# EAGLE design led_cube_final (EAGLE 6.5.0)
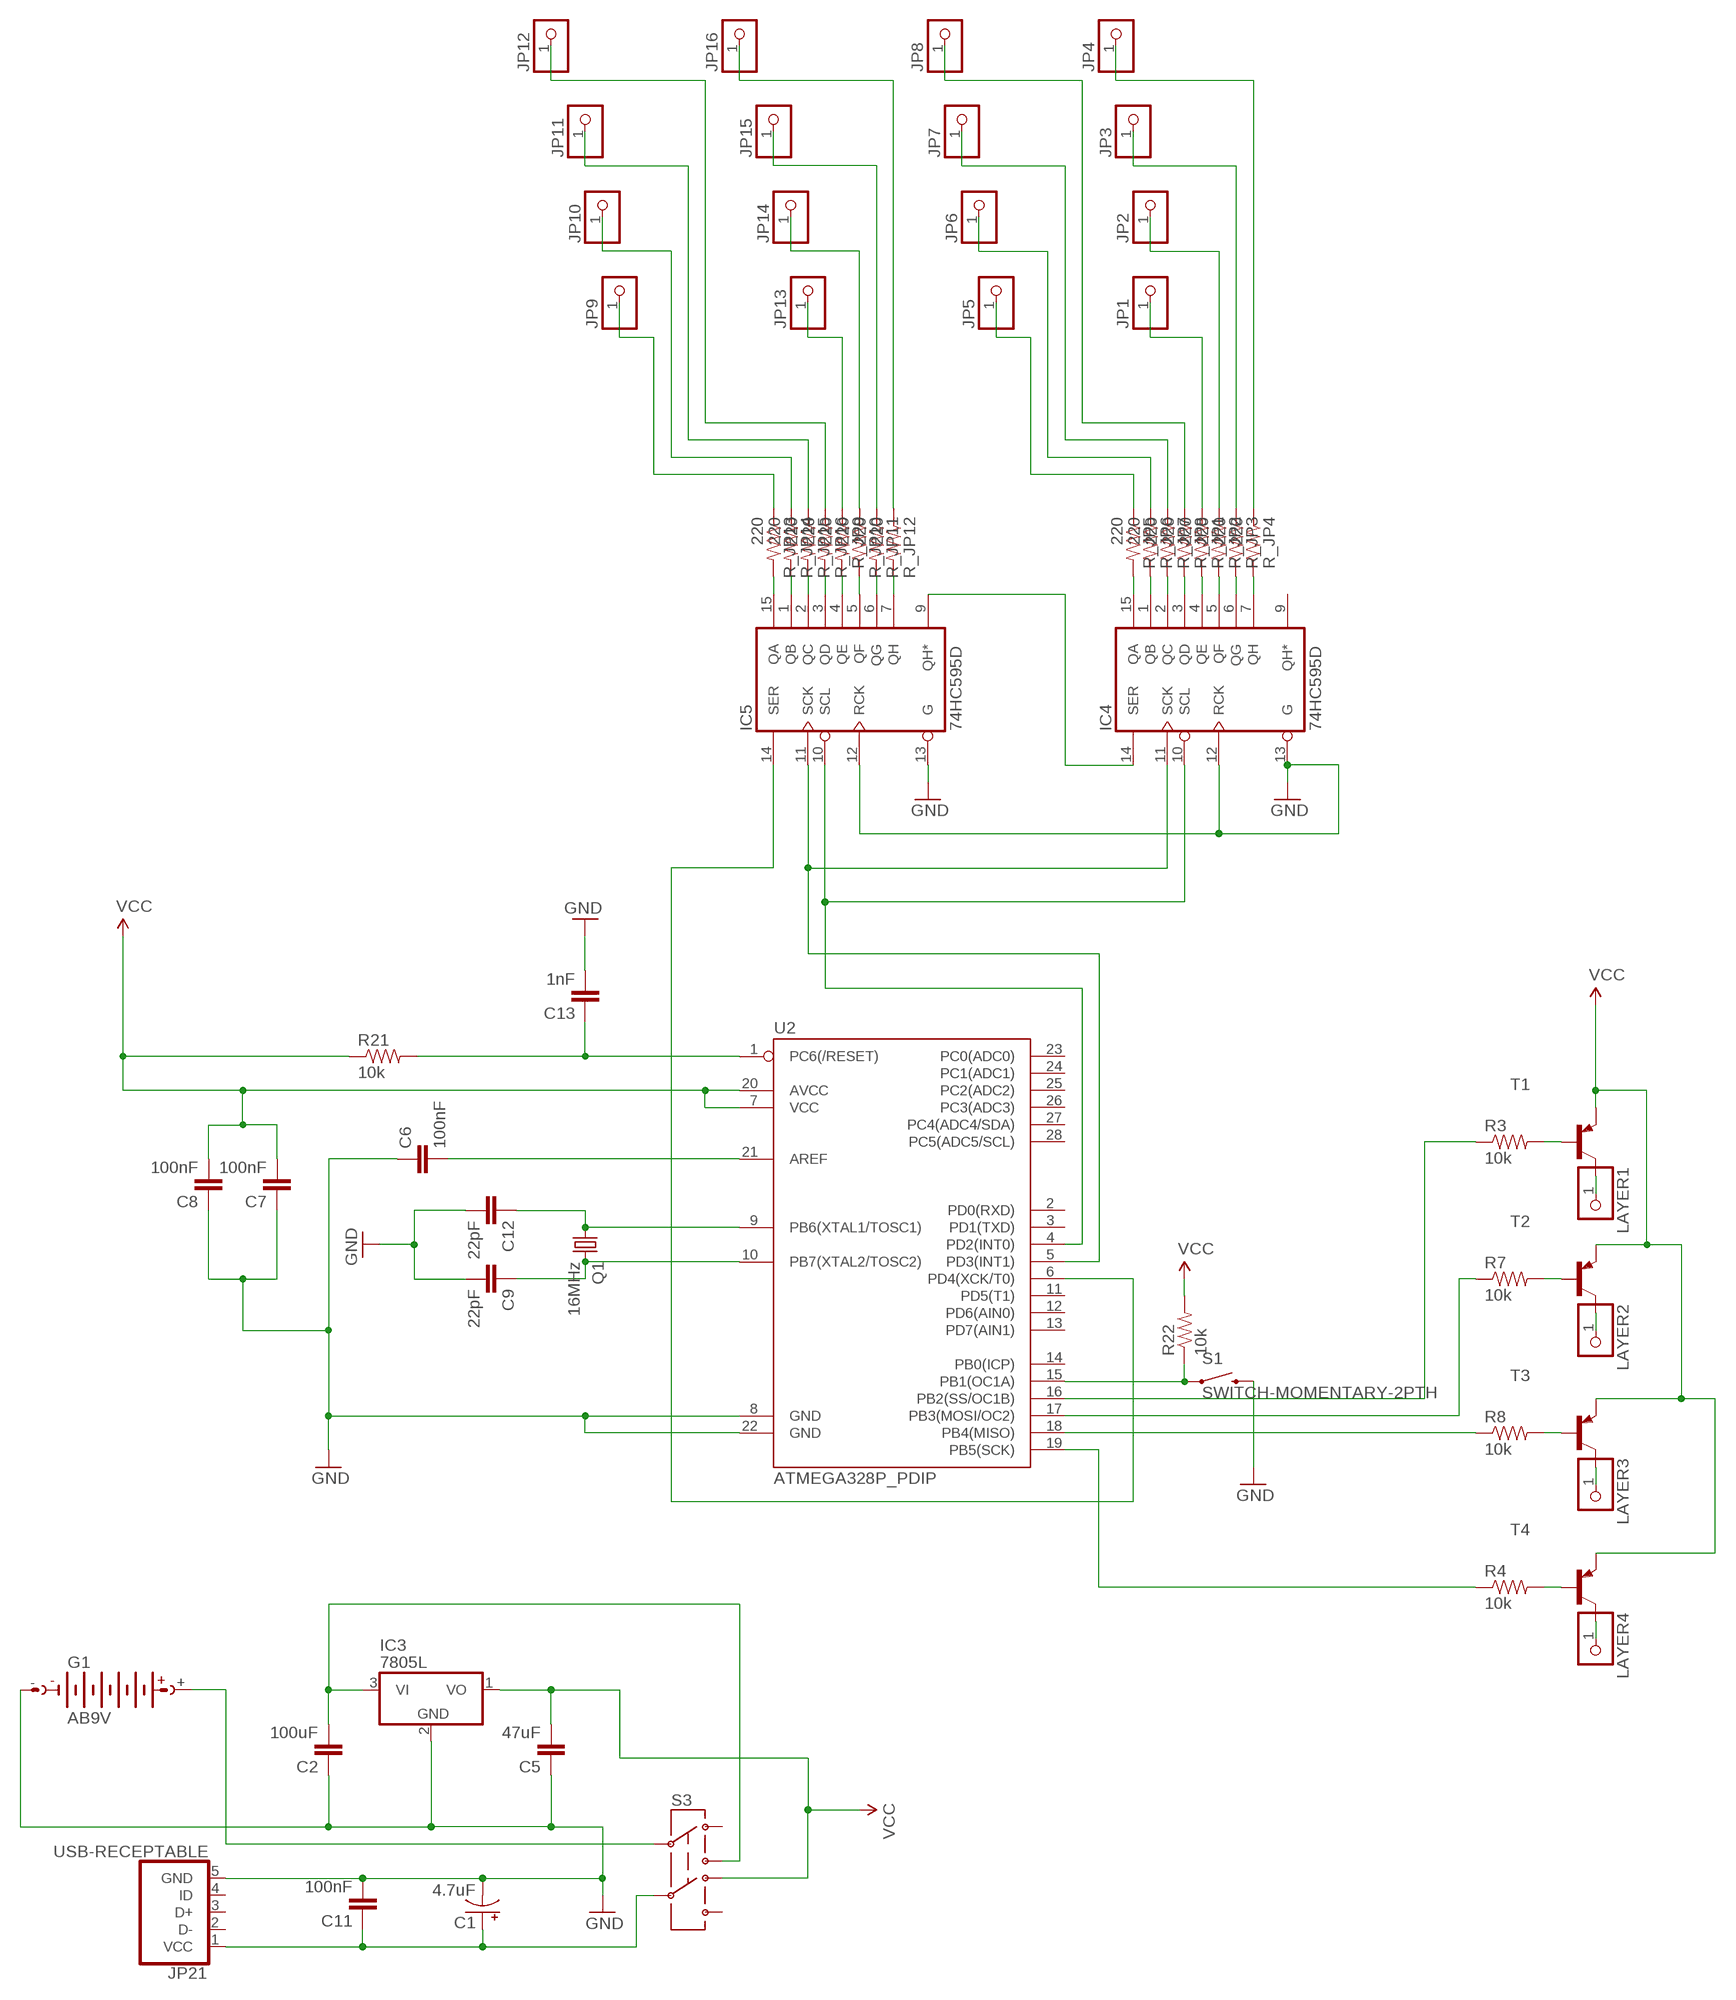
[diagram p0: schematic, sheet 1]

## Parts
C1  4.7uF  CPOL-USE2-5  [E2-5]
C2  100uF  CAP0805  [0805]
C5  47uF  CAP0805  [0805]
C6  100nF  CAP0805  [0805]
C7  100nF  CAP0805  [0805]
C8  100nF  CAP0805  [0805]
C9  22pF  CAP0805  [0805]
C11  100nF  CAP0805  [0805]
C12  22pF  CAP0805  [0805]
C13  1nF  CAP0805  [0805]
G1  AB9V  [AB9V]
IC3  7805L  [TO92]
IC4  74HC595D  [SO16]
IC5  74HC595D  [SO16]
JP1  PINHD-1X1  [1X01]
JP2  PINHD-1X1  [1X01]
JP3  PINHD-1X1  [1X01]
JP4  PINHD-1X1  [1X01]
JP5  PINHD-1X1  [1X01]
JP6  PINHD-1X1  [1X01]
JP7  PINHD-1X1  [1X01]
JP8  PINHD-1X1  [1X01]
JP9  PINHD-1X1  [1X01]
JP10  PINHD-1X1  [1X01]
JP11  PINHD-1X1  [1X01]
JP12  PINHD-1X1  [1X01]
JP13  PINHD-1X1  [1X01]
JP14  PINHD-1X1  [1X01]
JP15  PINHD-1X1  [1X01]
JP16  PINHD-1X1  [1X01]
JP21  USB-RECEPTABLE  [FCI-10103594-0001LF]
LAYER1  PINHD-1X1  [1X01]
LAYER2  PINHD-1X1  [1X01]
LAYER3  PINHD-1X1  [1X01]
LAYER4  PINHD-1X1  [1X01]
Q1  16MHz  CRYSTALHC49S  [HC49/S]
R3  10k  RESISTOR0805-RES  [0805]
R4  10k  RESISTOR0805-RES  [0805]
R7  10k  RESISTOR0805-RES  [0805]
R8  10k  RESISTOR0805-RES  [0805]
R21  10k  RESISTOR0805-RES  [0805]
R22  10k  RESISTOR0805-RES  [0805]
R_JP1  220  RESISTOR0805-RES  [0805]
R_JP2  220  RESISTOR0805-RES  [0805]
R_JP3  220  RESISTOR0805-RES  [0805]
R_JP4  220  RESISTOR0805-RES  [0805]
R_JP5  220  RESISTOR0805-RES  [0805]
R_JP6  220  RESISTOR0805-RES  [0805]
R_JP7  220  RESISTOR0805-RES  [0805]
R_JP8  220  RESISTOR0805-RES  [0805]
R_JP9  220  RESISTOR0805-RES  [0805]
R_JP10  220  RESISTOR0805-RES  [0805]
R_JP11  220  RESISTOR0805-RES  [0805]
R_JP12  220  RESISTOR0805-RES  [0805]
R_JP13  220  RESISTOR0805-RES  [0805]
R_JP14  220  RESISTOR0805-RES  [0805]
R_JP15  220  RESISTOR0805-RES  [0805]
R_JP16  220  RESISTOR0805-RES  [0805]
S1  SWITCH-MOMENTARY-2PTH  [TACTILE-PTH]
S3  SWITCH-DPDTOS  [OS]
T1  BC327-16-PNP-TO92-EBC  [TO92-EBC]
T2  BC327-16-PNP-TO92-EBC  [TO92-EBC]
T3  BC327-16-PNP-TO92-EBC  [TO92-EBC]
T4  BC327-16-PNP-TO92-EBC  [TO92-EBC]
U2  ATMEGA328P_PDIP  [DIL28-3]

## Nets
GND: C1.- C2.1 C5.1 C6.1 C7.1 C8.1 C9.2 C11.2 C12.2 C13.2 G1.- IC3.2(GND) IC4.12(RCK) IC4.13(G) IC5.12(RCK) IC5.13(G) JP21.5(GND) S1.3 U2.8(GND) U2.22(GND)
N$1: R4.2 T4.B
N$2: R3.2 T1.B
N$3: R7.2 T2.B
N$4: IC4.10(SCL) IC5.10(SCL) U2.4(PD2(INT0))
N$5: JP1.1 R_JP1.1
N$6: JP2.1 R_JP2.1
N$7: R8.2 T3.B
N$8: JP3.1 R_JP3.1
N$9: JP4.1 R_JP4.1
N$10: JP5.1 R_JP5.1
N$11: JP6.1 R_JP6.1
N$12: R22.1 S1.1 U2.15(PB1(OC1A))
N$13: LAYER3.1 T3.C
N$14: R4.1 U2.19(PB5(SCK))
N$15: JP7.1 R_JP7.1
N$16: JP8.1 R_JP8.1
N$17: JP13.1 R_JP9.1
N$18: JP14.1 R_JP10.1
N$19: JP15.1 R_JP11.1
N$20: JP16.1 R_JP12.1
N$21: JP9.1 R_JP13.1
N$22: JP10.1 R_JP14.1
N$23: JP11.1 R_JP15.1
N$24: JP12.1 R_JP16.1
N$25: IC4.7(QH) R_JP4.2
N$26: IC4.6(QG) R_JP3.2
N$27: IC4.5(QF) R_JP2.2
N$28: IC4.4(QE) R_JP1.2
N$29: IC4.3(QD) R_JP8.2
N$30: IC4.2(QC) R_JP7.2
N$31: IC4.1(QB) R_JP6.2
N$32: IC4.15(QA) R_JP5.2
N$33: IC5.7(QH) R_JP12.2
N$34: IC5.6(QG) R_JP11.2
N$35: IC5.5(QF) R_JP10.2
N$36: IC5.4(QE) R_JP9.2
N$37: IC5.3(QD) R_JP16.2
N$38: IC5.2(QC) R_JP15.2
N$39: IC5.1(QB) R_JP14.2
N$40: IC5.15(QA) R_JP13.2
N$41: IC4.14(SER) IC5.9(QH*)
N$42: LAYER4.1 T4.C
N$43: R8.1 U2.18(PB4(MISO))
N$44: IC4.11(SCK) IC5.11(SCK) U2.5(PD3(INT1))
N$45: C2.2 IC3.3(VI) S3.3
N$47: C9.1 Q1.2 U2.10(PB7(XTAL2/TOSC2))
N$48: IC5.14(SER) U2.6(PD4(XCK/T0))
N$49: R7.1 U2.17(PB3(MOSI/OC2))
N$50: C12.1 Q1.1 U2.9(PB6(XTAL1/TOSC1))
N$51: LAYER2.1 T2.C
N$52: LAYER1.1 T1.C
N$55: R3.1 U2.16(PB2(SS/OC1B))
N$56: C13.1 R21.2 U2.1(PC6(/RESET))
N$58: C6.2 U2.21(AREF)
N$59: G1.+ S3.2
N$63: C1.+ C11.1 JP21.1(VCC) S3.5
VCC: C5.2 C7.2 C8.2 IC3.1(VO) R21.1 R22.2 S3.4 T1.E T2.E T3.E T4.E U2.7(VCC) U2.20(AVCC)
Unconnected: IC4.9(QH*) JP21.2(D-) JP21.3(D+) JP21.4(ID) S3.1 S3.6 U2.2(PD0(RXD)) U2.3(PD1(TXD)) U2.11(PD5(T1)) U2.12(PD6(AIN0)) U2.13(PD7(AIN1)) U2.14(PB0(ICP)) U2.23(PC0(ADC0)) U2.24(PC1(ADC1)) U2.25(PC2(ADC2)) U2.26(PC3(ADC3)) U2.27(PC4(ADC4/SDA)) U2.28(PC5(ADC5/SCL))

## Power pins joined to a net without a drawn wire
GND: IC4.8(GND) IC5.8(GND)
VCC: IC4.16(VCC) IC5.16(VCC)

## Library data of the parts
C1 = adafruit:CPOL-US: POLARIZED CAPACITOR, American symbol
C2 C5-C9 C11-C13 = SparkFun-Passives:CAP: Capacitor Standard 0603 ceramic capacitor, and 0.1" leaded capacitor.
G1 = battery:AB9V: 9-V BATTERY CLIP
IC3 = adafruit:78*: Positive VOLTAGE REGULATOR Added bigger pads to the TO-92 package
IC4 IC5 = 74xx-eu:74*595: 8-bit SHIFT REGISTER, output latch
JP1-JP16 LAYER1-LAYER4 = adafruit:PINHD-1X1: Pin header 1x1 for 0.1" spacing With round pins
JP21 = daspilker:USB-RECEPTABLE: USB Receptable
Q1 = adafruit:CRYSTAL: CRYSTAL; OC_FARNELL: 1667008; OC_NEWARK: unknown
R3 R4 R7 R8 R21 R22 R_JP1-R_JP16 = SparkFun-Resistors:RESISTOR: Resistor Basic schematic elements and footprints for 0603, 1206, and PTH resistors.
S1 = SparkFun-Electromechanical:SWITCH-MOMENTARY-2: Various NO switches- pushbuttons, reed, etc
S3 = SparkFun-Electromechanical:SWITCH-DPDT: DPDT Version of the COM-00597
T1-T4 = transistor:*-PNP-: PNP Transistror
U2 = SparkFun-DigitalIC:ATMEGA328P_PDIP: uC used in the Arduino 32kb flash, 1k EEPROM, 2k SRAM This is the through-hole version of this chip.

## Board
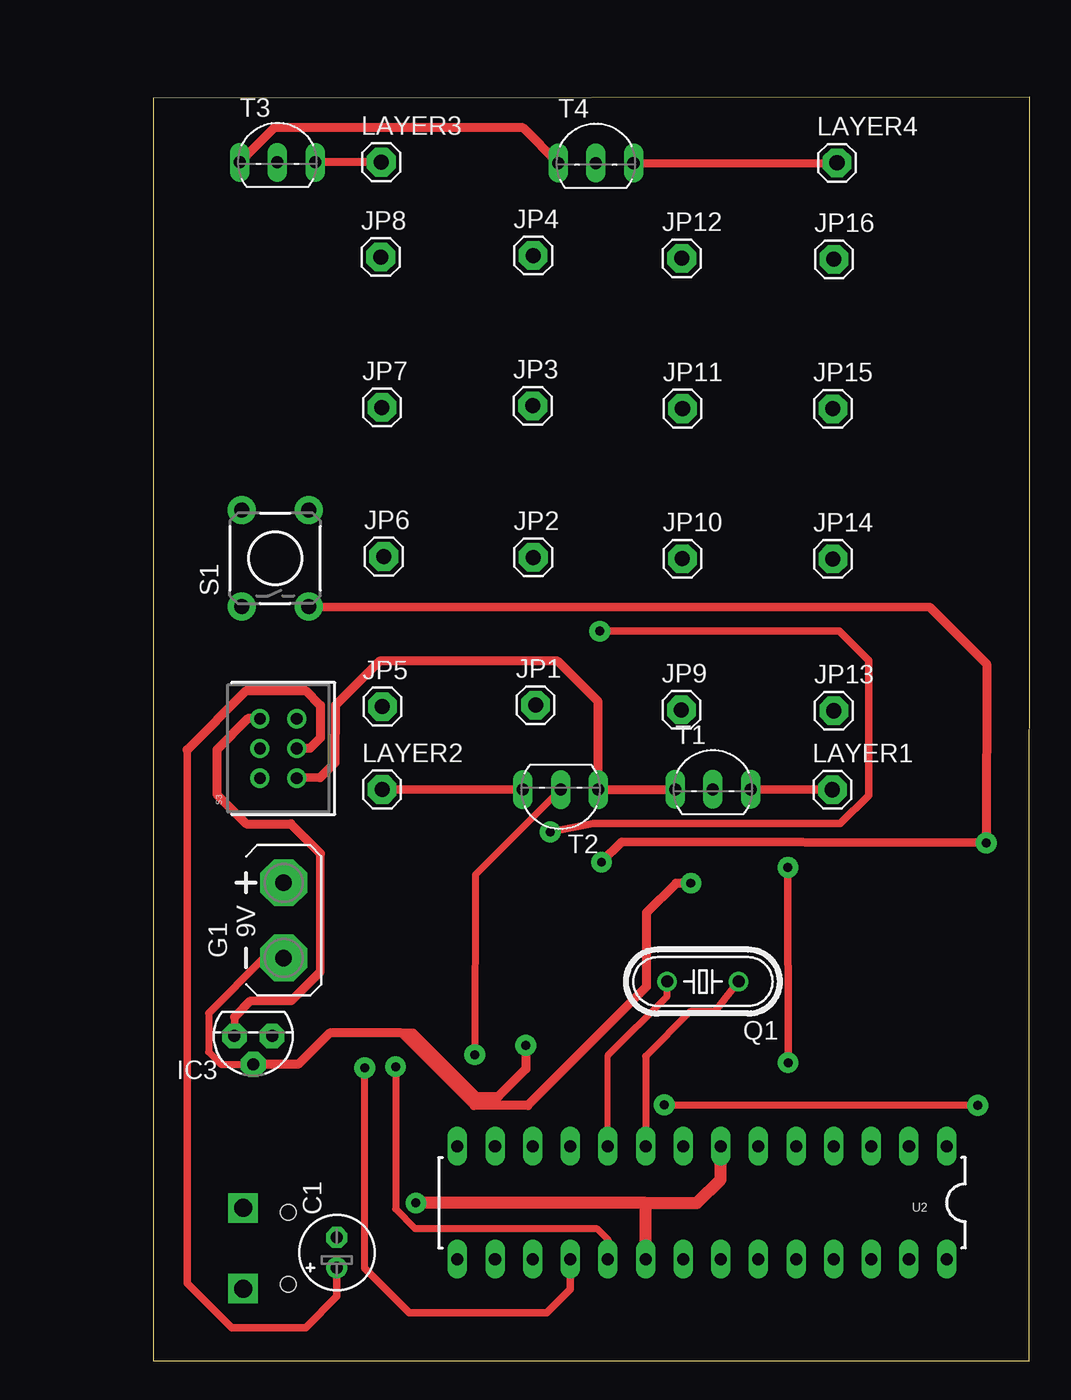
[diagram p1: board, top side]
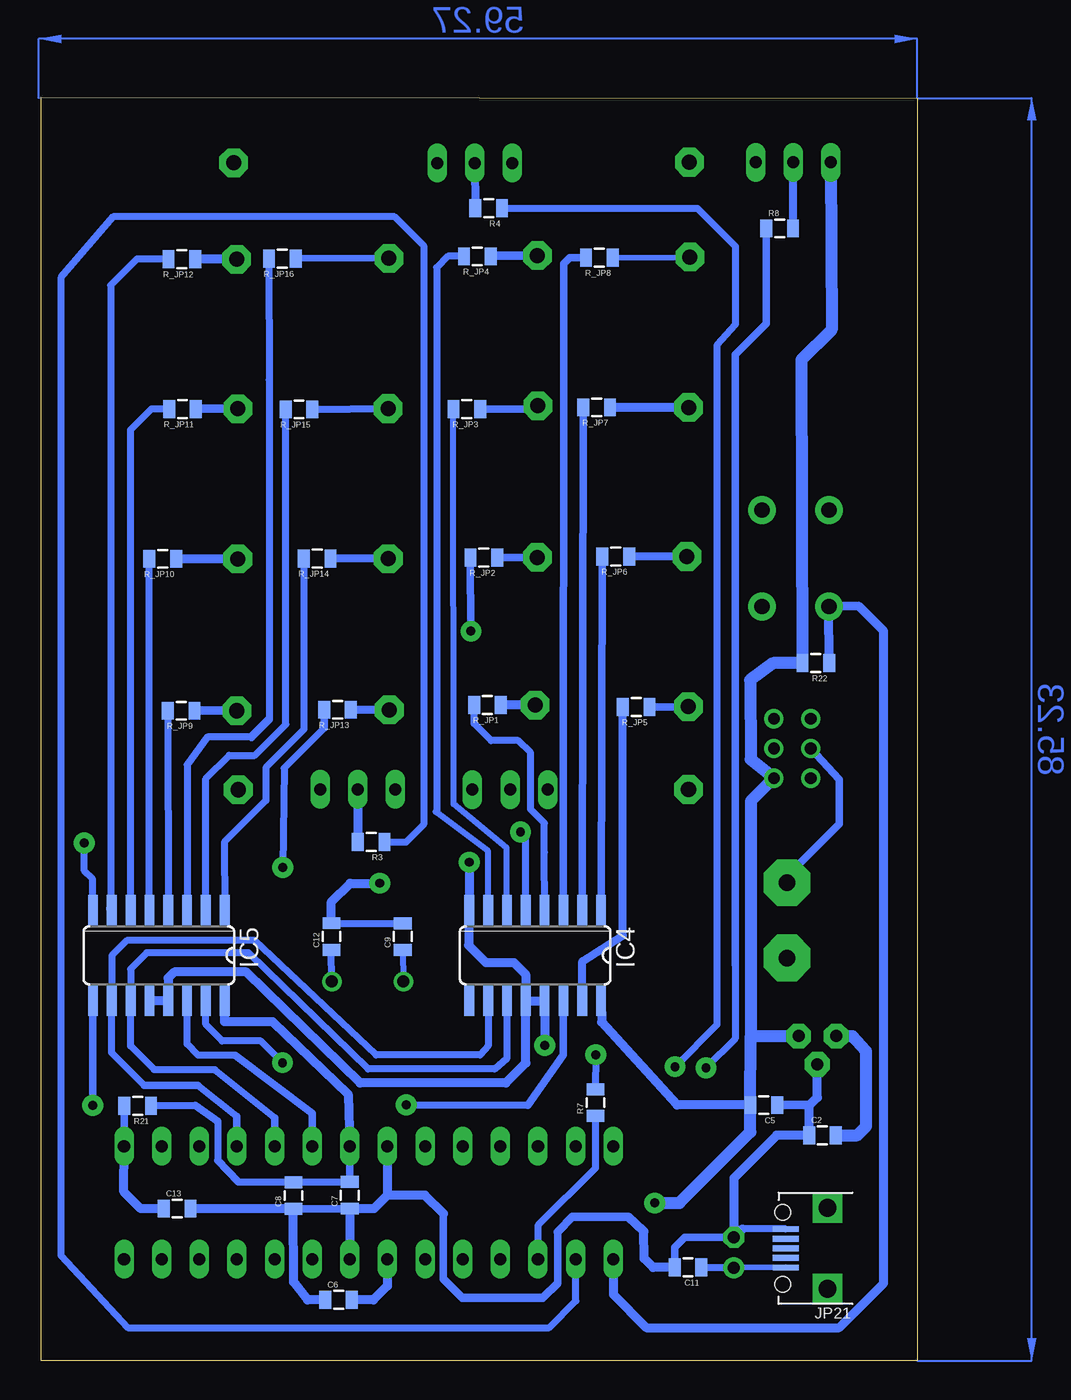
[diagram p2: board, bottom side, seen from below]

Size 59.13 x 85.3 mm. Coordinates in mm from the lower left corner, seen from the top.
Outline: 0,0.02 59.11,0 59.13,85.3 0,85.25 0,0.02
Copper layers (1*16): Top 0.035mm / dielectric 1.5mm / Bottom 0.035mm
Design rules "default *": minimum track width 20mil, minimum drill 24mil, track to track 8mil, track to pad 8mil, pad to pad 8mil, via to via 8mil, smd to smd 8mil, copper to edge 40mil, drill to drill 8mil, minimum pad ring 10mil, minimum via ring 8mil, stop-mask expansion 4mil, vias tented up to drill 0mil, thermal gap 10mil

### Footprints (pad centres in the part's own frame; a part is rotated, then mirrored left to right if it is on the bottom)
E2-5 = drill 0.813 pad 1.422: + -1.016,0 | drill 0.813 pad 1.422 octagon: - 1.016,0
0805 = smd 0.8 x 1.2: 1 -0.9,0; 2 0.9,0
AB9V = drill 1.118 pad 3.15 octagon: + 0,2.54; - 0,-2.54
TO92 = drill 0.813 pad 1.676 octagon: 1 -1.27,0; 2 0,1.905; 3 1.27,0
SO16 = smd 0.66 x 2.032: 1 -4.445,-3.073; 2 -3.175,-3.073; 3 -1.905,-3.073; 4 -0.635,-3.073; 5 0.635,-3.073; 6 1.905,-3.073; 7 3.175,-3.073; 8 4.445,-3.073; 9 4.445,3.073; 10 3.175,3.073; 11 1.905,3.073; 12 0.635,3.073; 13 -0.635,3.073; 14 -1.905,3.073; 15 -3.175,3.073; 16 -4.445,3.073
1X01 = drill 1.016 pad 1.93 octagon: 1 0,0
FCI-10103594-0001LF = smd 0.4 x 1.75: 1 -1.3,4.525; 2 -0.65,4.525; 3 0,4.525; 4 0.65,4.525; 5 1.3,4.525 | drill 1.2 pad 2 square: P$3 -2.725,1.7; P$4 2.725,1.7 | hole 1.05: -2.425,4.73; 2.425,4.73
HC49/S = drill 0.813: 1 -2.413,0; 2 2.413,0
TACTILE-PTH = drill 1.016 pad 1.88: 1 -3.251,2.261; 2 3.251,2.261; 3 -3.251,-2.261; 4 3.251,-2.261
OS = drill 0.787 pad 1.27: 1 -2.007,1.245; 2 0,1.245; 3 2.007,1.245; 4 -2.007,-1.245; 5 0,-1.245; 6 2.007,-1.245
TO92-EBC = drill 0.813 long: B 0,-1.27; C 2.54,-1.27; E -2.54,-1.27
DIL28-3 = drill 0.813 long: 1 -16.51,-3.81; 2 -13.97,-3.81; 3 -11.43,-3.81; 4 -8.89,-3.81; 5 -6.35,-3.81; 6 -3.81,-3.81; 7 -1.27,-3.81; 8 1.27,-3.81; 9 3.81,-3.81; 10 6.35,-3.81; 11 8.89,-3.81; 12 11.43,-3.81; 13 13.97,-3.81; 14 16.51,-3.81; 15 16.51,3.81; 16 13.97,3.81; 17 11.43,3.81; 18 8.89,3.81; 19 6.35,3.81; 20 3.81,3.81; 21 1.27,3.81; 22 -1.27,3.81; 23 -3.81,3.81; 24 -6.35,3.81; 25 -8.89,3.81; 26 -11.43,3.81; 27 -13.97,3.81; 28 -16.51,3.81

### Placement (x,y rotation side)
C1  12.37,7.31 90 top
C2  6.39,15.23 0 bottom
C5  10.35,17.27 180 bottom
C6  39.05,4.12 0 bottom
C7  38.29,11.18 90 bottom
C8  42.09,11.16 90 bottom
C9  34.71,28.64 90 bottom
C11  15.47,6.31 180 bottom
C12  39.53,28.65 90 bottom
C13  49.94,10.28 0 bottom
G1  8.79,29.74 0 top
IC3  6.73,21.93 180 top
IC4  25.78,27.38 180 bottom
IC5  51.18,27.38 180 bottom
JP1  25.78,44.27 0 top
JP2  25.63,54.25 0 top
JP3  25.6,64.48 0 top
JP4  25.63,74.63 0 top
JP5  15.44,44.17 0 top
JP6  15.54,54.31 0 top
JP7  15.42,64.37 0 top
JP8  15.34,74.52 0 top
JP9  35.63,43.95 0 top
JP10  35.69,54.16 0 top
JP11  35.7,64.29 0 top
JP12  35.65,74.44 0 top
JP13  45.92,43.89 0 top
JP14  45.85,54.14 0 top
JP15  45.85,64.29 0 top
JP16  45.92,74.37 0 top
JP21  4.35,7.6 90 bottom
LAYER1  45.82,38.56 0 top
LAYER2  15.43,38.57 0 top
LAYER3  15.37,80.93 0 top
LAYER4  46.13,80.89 0 top
Q1  37.08,25.61 180 top
R3  36.85,35.03 180 bottom
R4  28.92,77.81 180 bottom
R7  21.71,17.43 90 bottom
R8  9.28,76.46 0 bottom
R21  52.61,17.22 180 bottom
R22  6.84,47.11 180 bottom
R_JP1  29,44.29 180 bottom
R_JP2  29.25,54.23 180 bottom
R_JP3  30.4,64.26 180 bottom
R_JP4  29.69,74.57 180 bottom
R_JP5  18.96,44.14 180 bottom
R_JP6  20.34,54.31 180 bottom
R_JP7  21.63,64.37 180 bottom
R_JP8  21.45,74.48 180 bottom
R_JP9  49.67,43.9 180 bottom
R_JP10  50.92,54.14 180 bottom
R_JP11  49.58,64.26 180 bottom
R_JP12  49.63,74.38 180 bottom
R_JP13  39.12,43.96 180 bottom
R_JP14  40.49,54.17 180 bottom
R_JP15  41.72,64.24 180 bottom
R_JP16  42.85,74.41 180 bottom
S1  8.21,54.19 90 top
S3  8.42,41.35 90 top
T1  37.75,39.85 0 top
T2  27.48,37.3 180 top
T3  8.37,82.19 0 top
T4  29.86,82.14 0 top
U2  37.02,10.68 180 top

### Tracks (layer width: path | path; a pad name or v marks a point on that pad's centre or on a via)
GND  (via drill 0.6 pad 1.4)
  Top 0.46: 3.71,23.45 3.71,20.85 4.54,20.03 IC3.2
  Top 0.51: 3.71,23.45 7.46,27.2
  Top 0.61: v30.23,33.67 31.59,35.03 v56.21,34.96 56.23,47.05 52.39,50.89 S1.3 | G1.- 7.46,27.2 | v36.27,32.25 35.27,32.25 33.27,30.25 33.27,25.25 25.27,17.25 21.64,17.25 16.75,22.13 | IC3.2 9.75,20.03 11.9,22.13 16.75,22.13 | 16.75,22.13 17.53,22.12 21.82,17.83 23.27,17.84 25.13,19.71 v25.13,21.29
  Bottom 0.46: JP21.5 11.8,8.9 | 35.74,11.19 35.75,11.18 | C12.2 C9.2 | IC5.8 55.65,32.52 56.21,33.08 v56.21,34.96
  Bottom 0.508: 30.27,30.25 IC4.8 | 26.27,24.25 IC4.12
  Bottom 0.51: C7.1 C8.1 | C1.- 15.68,8.33 16.36,7.65 C11.2 | 24.27,8.7 24.27,5.25 | 31.97,5.54 31.97,9.95
  Bottom 0.53: 23.29,9.71 24.27,8.7 | 24.27,5.25 25.27,4.25 | 30.68,4.25 31.97,5.54
  Bottom 0.56: C1.- | 25.27,4.25 30.68,4.25 | 19.51,9.71 23.29,9.71
  Bottom 0.61: 11.8,8.9 C1.- 12.37,12.34 9.48,15.23 C2.1 7.27,17.25 | U2.8 35.75,11.18 36.67,10.27 C7.1 U2.22 | C13.2 C8.1 42.09,5.33 41.14,4.12 C6.1 | v30.23,33.67 IC4.8 | 31.97,9.95 33.22,11.19 35.74,11.19 | 7.27,17.25 C5.1 | 7.27,17.25 6.73,17.79 IC3.2 | C12.2 39.53,30.99 38.27,32.25 v36.27,32.25 | 30.27,30.25 30.27,28.06 29.11,26.9 27.21,26.9 26.42,26.1 IC4.12 26.41,20.1 27.77,18.75 35.68,18.77 35.78,18.77 37.6,18.75 45.27,26.25 50.14,26.25 50.55,25.84 IC5.13 IC5.12 | v25.13,21.29 IC4.13 26.21,24.31 26.27,24.25 | C11.2 17.82,6.31 18.42,6.91 18.44,8.73 19.51,9.71
N$1
  Bottom 0.53: T4.B R4.2
N$2
  Bottom 0.61: T1.B R3.2
N$3  (via drill 0.6 pad 1.4)
  Top 0.46: v21.69,20.67 21.72,32.81 T2.B
  Bottom 0.46: v21.69,20.67 R7.2
N$4
  Bottom 0.46: IC4.10 28.95,21.25 29.49,20.65 36.52,20.65 44.7,28.37 53.34,28.37 54.35,27.36 IC5.10 54.36,21.12 54.36,20.8 52.16,18.6
  Bottom 0.51: U2.4 45.92,16.49 48.57,18.6 52.16,18.6
N$5
  Bottom 0.61: JP1.1 R_JP1.1
N$6
  Bottom 0.508: R_JP2.1 28.27,54.25 26.27,54.25 JP2.1
N$7
  Bottom 0.53: R8.2 T3.B
N$8
  Bottom 0.508: R_JP3.1 28.27,64.25 26.27,64.25 JP3.1
N$9
  Bottom 0.61: JP4.1 R_JP4.1
N$10
  Bottom 0.53: R_JP5.1 JP5.1
N$11
  Bottom 0.53: JP6.1 R_JP6.1
N$12
  Bottom 0.61: U2.15 20.51,4.49 18.27,2.25 5.27,2.25 2.27,5.25 2.27,49.26 3.95,50.95 S1.1 R22.1
N$13
  Top 0.53: LAYER3.1 T3.C
N$14  (via drill 0.6 pad 1.4)
  Top 0.46: v16.34,19.86 16.34,10.25 17.65,8.94 29.91,8.94 30.68,8.17 U2.19
  Bottom 0.46: R4.1 14.84,77.81 12.27,75.25 12.27,69.97 13.51,68.56 13.51,22.68 v16.34,19.86
N$15
  Bottom 0.61: JP7.1 R_JP7.1
N$16
  Bottom 0.406: R_JP8.1 JP8.1
N$17
  Bottom 0.61: JP13.1 R_JP9.1
N$18
  Bottom 0.61: JP14.1 R_JP10.1
N$19
  Bottom 0.61: JP15.1 R_JP11.1
N$20
  Bottom 0.61: JP16.1 R_JP12.1
N$21
  Bottom 0.508: 38.27,44.25 R_JP13.1
  Bottom 0.53: JP9.1 R_JP13.1
N$22
  Bottom 0.53: JP10.1 R_JP14.1
N$23
  Bottom 0.508: 36.27,64.25 JP11.1
  Bottom 0.51: R_JP15.1 JP11.1
N$24
  Bottom 0.46: JP12.1 R_JP16.1
N$25
  Bottom 0.406: IC4.7 28.96,34.42 32.47,37.07
  Bottom 0.46: R_JP4.2 31.67,74.57 32.43,73.81 32.43,37.12 32.47,37.07
N$26
  Bottom 0.406: IC4.6 27.71,34.63 31.28,37.6 R_JP3.2
N$27  (via drill 0.6 pad 1.4)
  Top 0.51: v30.12,49.26 46.29,49.26 48.27,47.28 48.27,38.19 46.36,36.27 29.69,36.28 v26.77,35.71
  Bottom 0.46: IC4.5 26.41,35.35 v26.77,35.71
  Bottom 0.51: R_JP2.2 v30.12,49.26
N$28
  Bottom 0.46: IC4.4 25.17,34.34 25.17,36.31 26.09,37.24 26.09,41.06 26.91,41.87 28.75,41.87 29.9,43.03 R_JP1.2
N$29
  Bottom 0.51: R_JP8.2 23.44,74.48 23.84,74.08 IC4.3
N$30
  Bottom 0.51: IC4.2 R_JP7.2
N$31
  Bottom 0.51: R_JP6.2 IC4.1
N$32
  Bottom 0.53: IC4.15 22.6,26.97 19.86,28.71 R_JP5.2
N$33
  Bottom 0.46: R_JP12.2 52.66,74.38 54.43,72.62 54.43,30.53
  Bottom 0.61: 54.43,30.53 IC5.7
N$34
  Bottom 0.46: R_JP11.2 51.69,64.26 53.1,62.84 53.1,30.47
  Bottom 0.61: 53.1,30.47 IC5.6
N$35
  Bottom 0.46: IC5.5 R_JP10.2
  Bottom 0.61: 51.83,30.46 IC5.5
N$36
  Bottom 0.46: R_JP9.2 IC5.4
N$37
  Bottom 0.46: 43.74,43.33 43.74,66.22 R_JP16.2 | 44.93,42.12 47.93,42.12 49.27,40.25 IC5.3
  Bottom 0.508: 49.27,31.25 IC5.3
  Bottom 0.53: 43.74,43.33 44.93,42.12 | IC5.3
N$38
  Bottom 0.46: IC5.2 48,39.32 46.44,40.88 44.7,40.88 42.61,42.97 R_JP15.2
N$39
  Bottom 0.46: R_JP14.2 41.39,42.63 43.96,40.06 43.96,37.82 46.75,35.03 IC5.1
N$40  (via drill 0.6 pad 1.4)
  Top 0.51: v42.82,33.32 v42.83,20.13
  Bottom 0.46: 40.02,42.71 42.72,40.01 v42.82,33.32 | v42.83,20.13 44.3,21.6 46.9,21.6 48,22.7 IC5.15
  Bottom 0.51: R_JP13.2 40.02,42.71
N$41  (via drill 0.6 pad 1.4)
  Top 0.51: v34.48,17.28 v55.63,17.25
  Bottom 0.51: IC4.14 23.88,20.64 26.27,17.25 v34.48,17.28 | v55.63,17.25 IC5.9
N$42
  Top 0.53: T4.C 46.11,80.87 LAYER4.1
N$43  (via drill 0.6 pad 1.4)
  Top 0.46: 14.27,6.25 v14.25,19.77
  Top 0.51: 14.27,6.25 17.27,3.25 26.53,3.25 28.12,4.83 U2.18
  Bottom 0.46: 12.28,26.75 12.28,21.75 v14.25,19.77
  Bottom 0.51: R8.1 10.18,70.03 12.28,67.93 12.28,26.75
N$44
  Bottom 0.46: IC4.11 27.68,20.43 28.51,19.71 37.05,19.71 45.13,27.54 52,27.54 53.09,26.46 IC5.11 53.08,22.32 53.08,21.25 51.5,19.67
  Bottom 0.51: U2.5 43.37,16.4 47.42,19.64 51.5,19.67
N$45
  Top 0.51: 5.47,23.22 IC3.3
  Top 0.56: 6.54,24.29 9.31,24.29 11.27,26.25 11.27,34.25
  Top 0.61: S3.3 6.38,43.36 4.27,41.25 4.27,38.25 6.27,36.25 9.27,36.25 11.27,34.25 | 6.54,24.29 5.47,23.22
  Bottom 0.813: C2.2 4.04,15.23 3.43,15.84 3.43,20.9 4.37,21.93 IC3.3
N$47
  Top 0.406: U2.10 30.67,20.61
  Top 0.46: 30.67,20.61 34.67,24.61 Q1.2
  Bottom 0.406: C9.1 Q1.2
N$48
  Bottom 0.46: 46.03,20.64 48.52,20.64 49.28,21.39 IC5.14
  Bottom 0.51: U2.6 40.83,16.71 46.03,20.64
N$49
  Bottom 0.46: R7.1 21.71,13.01 25.59,9.13 U2.17
N$50
  Top 0.46: U2.9 33.22,20.56 36.27,23.61 37.96,23.61 Q1.1
  Bottom 0.46: Q1.1 C12.1
N$51
  Top 0.59: LAYER2.1 T2.C
N$52
  Top 0.59: T1.C 45.8,38.58 LAYER1.1
N$55
  Bottom 0.46: R3.1 34.49,35.03 33.27,36.25 33.27,75.25 35.27,77.25 54.27,77.25 57.8,73.12 57.8,7.12 53.27,2.25 24.85,2.25 23.04,4.05 U2.16
  Bottom 0.51: 23.03,6.85 U2.16
N$56
  Bottom 0.51: U2.1 R21.2
  Bottom 0.61: C13.1 52.39,10.28 53.54,11.42 U2.1
N$58
  Bottom 0.61: U2.21 35.75,5.07 36.7,4.11 C6.2
N$59
  Bottom 0.508: 5.27,39.25 5.27,36.25 8.27,33.25 G1.+
  Bottom 0.51: 5.27,39.25 S3.2
N$63
  Top 0.51: C1.+ 12.37,4.35 10.27,2.25 5.27,2.25 2.27,5.25 2.27,41.25
  Top 0.61: 2.27,41.25 6.27,45.25 10.27,45.25 11.27,44.25 11.27,42.06 10.56,41.35 S3.5
  Bottom 0.406: JP21.1 C1.+
  Bottom 0.51: C1.+ C11.1
VCC  (via drill 0.6 pad 1.4)
  Top 0.61: T4.E 24.94,83.25 8.15,83.25 T3.E | T1.E T2.E 30.02,44.5 27.27,47.25 15.27,47.25 12.27,44.25 12.25,40.38 11.25,39.38 S3.4
  Top 0.813: 33.21,10.65 v17.71,10.66 | U2.20 33.21,10.65 | 33.21,10.65 36.67,10.65 38.27,12.25 U2.7
  Bottom 0.46: 7.81,67.57 | 47.21,16.16 47.21,13.53 | 21.31,24.28 IC4.16
  Bottom 0.51: R21.1 48.73,17.24 47.21,16.16 | 47.21,13.53 45.83,12.09 C8.2 C7.2 U2.7
  Bottom 0.61: U2.7 38.4,18 43.49,22.89 46.73,22.89 IC5.16 | C5.2 16.19,17.27 21.3,22.87 21.31,24.28
  Bottom 0.813: T3.E 5.78,69.6 7.81,67.57 | 7.81,67.57 R22.2 9.71,47.11 11.26,45.96 11.24,40.62 S3.4 11.23,37.78 11.23,21.93 | 11.23,21.93 IC3.1 | 11.23,21.93 C5.2 11.25,15.46 16.05,10.66 v17.71,10.66
(copper drawn outside any net)
  shapes: Bottom area x2